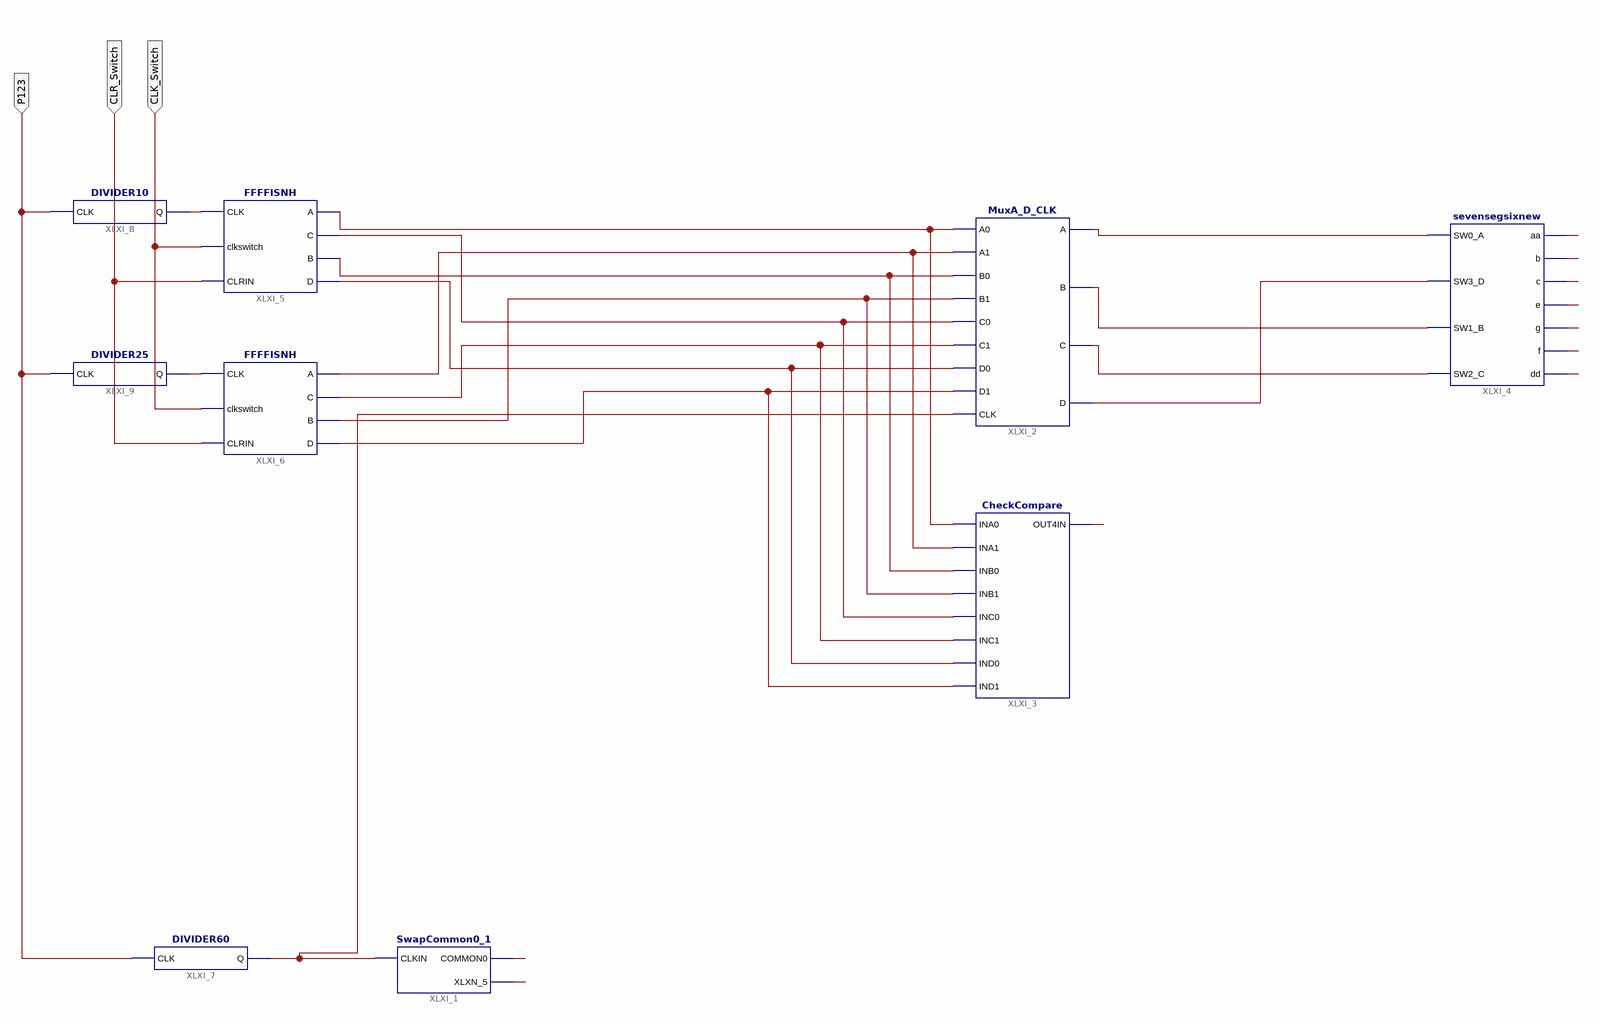
[diagram p0: schematic sheet 1]
// Xilinx ISE schematic sixxxx.sch (spartan6) as structural Verilog: 9 symbols, 3 ports
module sixxxx (
  input  CLR_Switch,
  input  CLK_Switch,
  input  P123
);

  wire a, b, buz, c, com0, com1, d, e, f, g, XLXN_1, XLXN_2, XLXN_3, XLXN_4, XLXN_5, XLXN_7, XLXN_8, XLXN_9,
       XLXN_11, XLXN_12, XLXN_13, XLXN_14, XLXN_57, XLXN_58, XLXN_62;

  SwapCommon0_1 XLXI_1 (.CLKIN(XLXN_62), .COMMON0(com0), .XLXN_5(com1));
  MuxA_D_CLK XLXI_2 (
    .A0(XLXN_8), .A1(XLXN_9), .B0(XLXN_5), .B1(XLXN_11), .C0(XLXN_12), .C1(XLXN_13), .D0(XLXN_14),
    .D1(XLXN_7), .CLK(XLXN_62), .A(XLXN_2), .B(XLXN_3), .C(XLXN_4), .D(XLXN_1));
  CheckCompare XLXI_3 (
    .INA0(XLXN_8), .INA1(XLXN_9), .INB0(XLXN_5), .INB1(XLXN_11), .INC0(XLXN_12), .INC1(XLXN_13),
    .IND0(XLXN_14), .IND1(XLXN_7), .OUT4IN(buz));
  sevensegsixnew XLXI_4 (
    .SW0_A(XLXN_2), .SW3_D(XLXN_1), .SW1_B(XLXN_3), .SW2_C(XLXN_4), .aa(a), .b(b), .c(c), .e(e), .g(g),
    .f(f), .dd(d));
  FFFFISNH XLXI_5 (
    .CLK(XLXN_57), .clkswitch(CLK_Switch), .CLRIN(CLR_Switch), .A(XLXN_8), .C(XLXN_12), .B(XLXN_5),
    .D(XLXN_14));
  FFFFISNH XLXI_6 (
    .CLK(XLXN_58), .clkswitch(CLK_Switch), .CLRIN(CLR_Switch), .A(XLXN_9), .C(XLXN_13), .B(XLXN_11),
    .D(XLXN_7));
  DIVIDER60 XLXI_7 (.CLK(P123), .Q(XLXN_62));
  DIVIDER10 XLXI_8 (.CLK(P123), .Q(XLXN_57));
  DIVIDER25 XLXI_9 (.CLK(P123), .Q(XLXN_58));
endmodule
